# Altium schematic sheet fx3_a.SchDoc: CYUSB3014 - A
size OrCAD B; CheckedBy: liuchao; DrawnBy: liuchao; DocumentNumber: APEX-USB4; Revision: 3.0.0; SheetNumber: 4; SheetTotal: 9
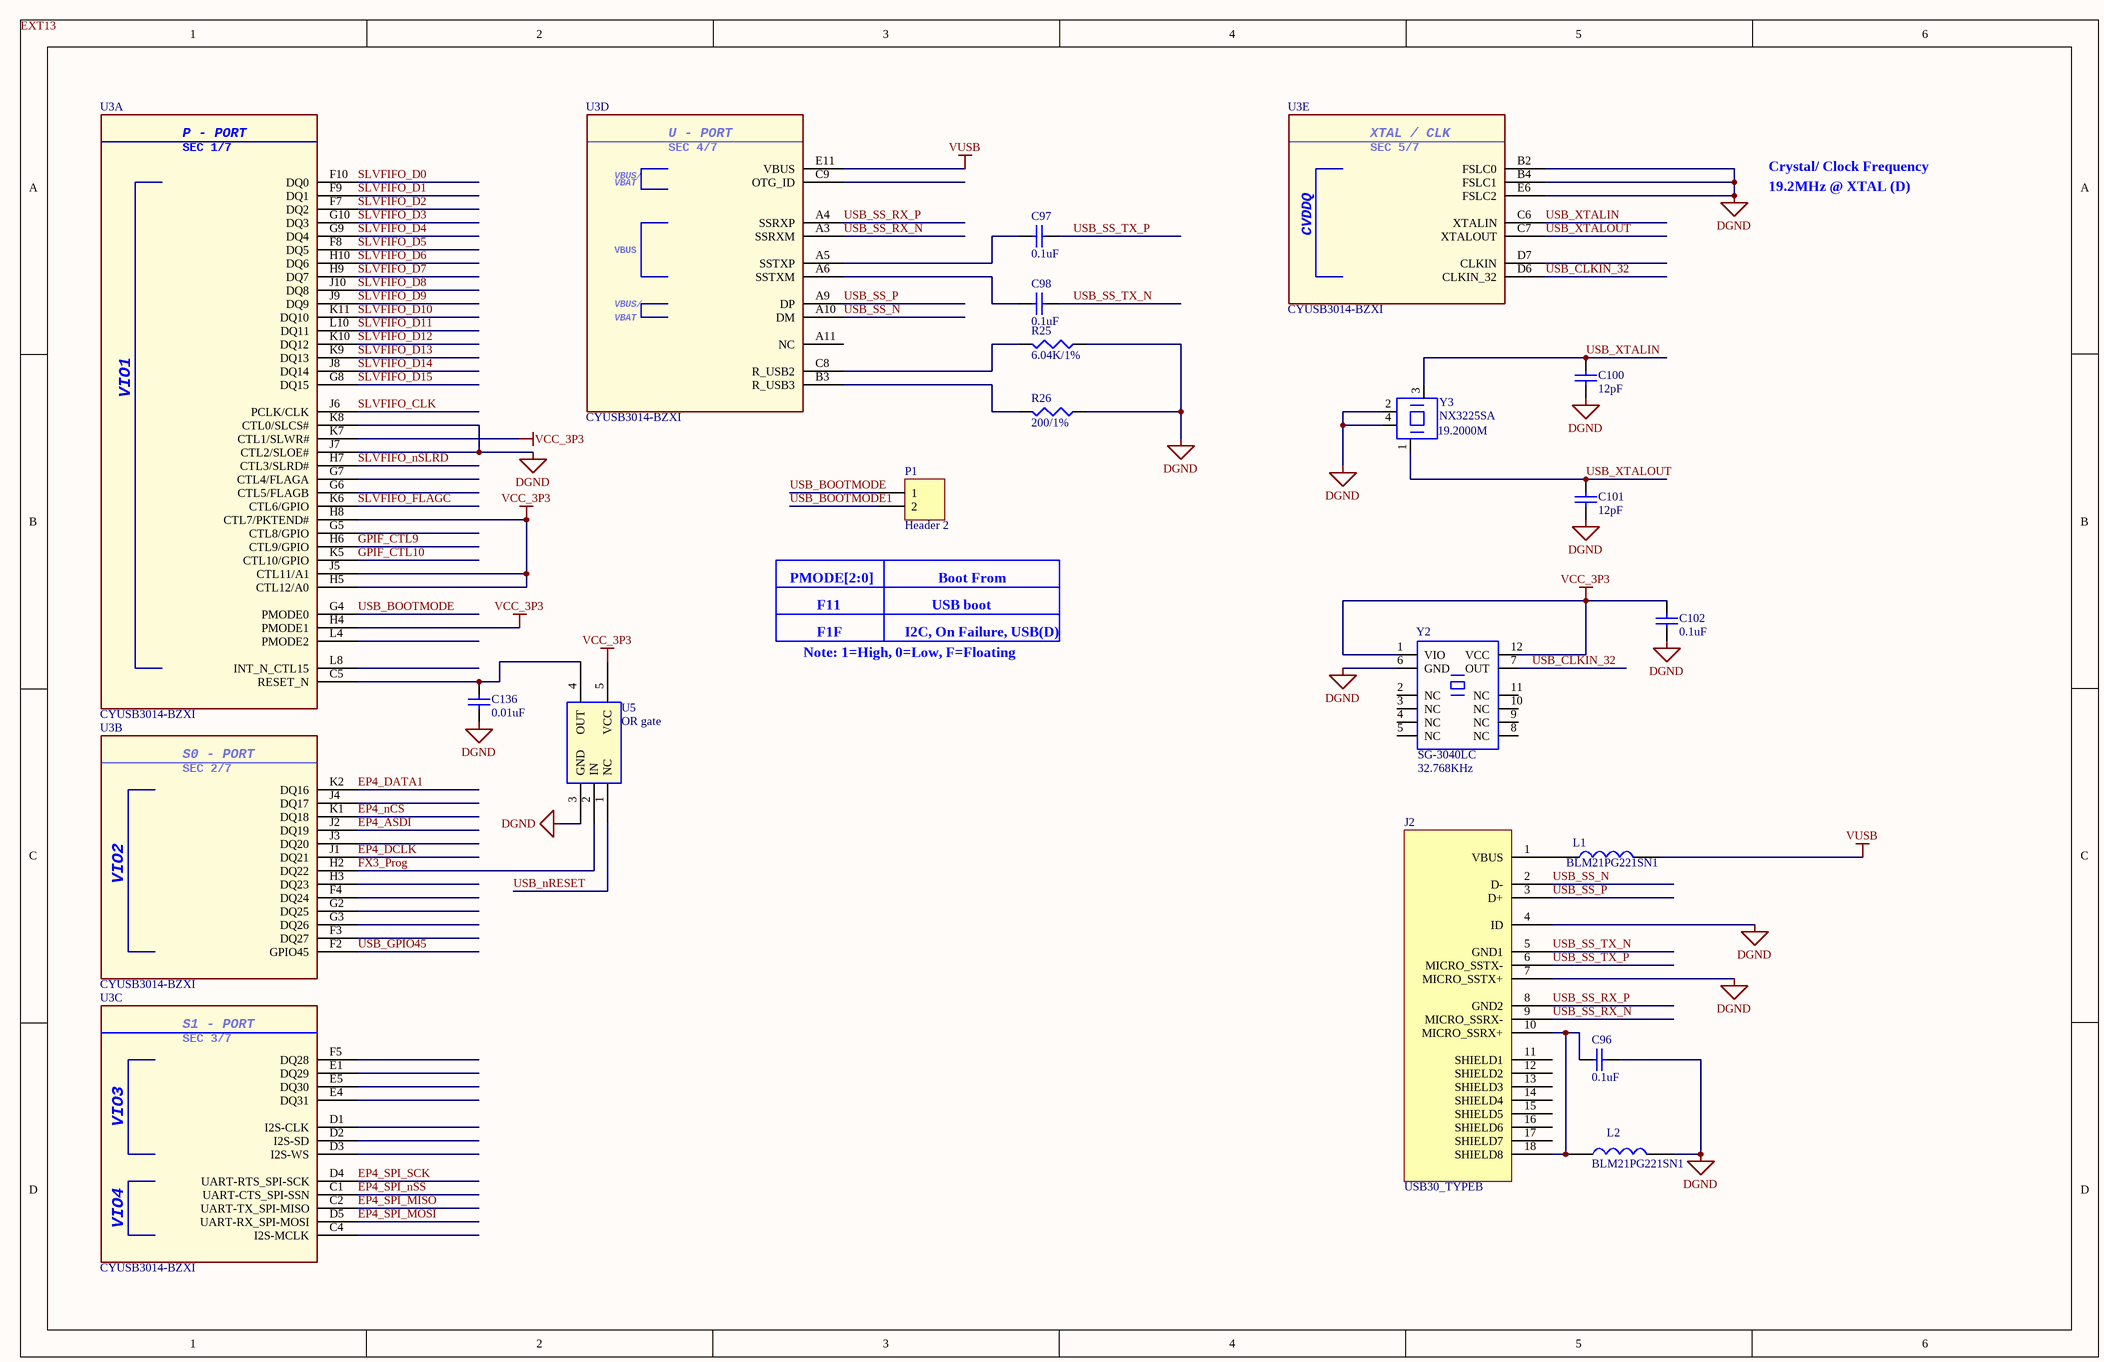
[diagram p0: fx3_a.SchDoc]

## Parts
C96  value 0.1uF  [C_0402]  (hidden comment: Capacitor)
C97  value 0.1uF  [C_0402]  (hidden comment: Capacitor)
C98  value 0.1uF  [C_0402]  (hidden comment: Capacitor)
C100  value 12pF  [C_0402]  (hidden comment: Capacitor)
C101  value 12pF  [C_0402]  (hidden comment: Capacitor)
C102  value 0.1uF  [C_0402]  (hidden comment: Capacitor)
C136  value 0.01uF  [C_0402]  (hidden comment: Capacitor)
J2  USB30_TYPEB  [USB3.0 typeB]
L1  BLM21PG221SN1  [SMD_0805]
L2  BLM21PG221SN1  [SMD_0805]
P1  Header 2  [HDR1X2]
R25  value 6.04K/1%  [J1-0603]  (hidden comment: Resistor)
R26  value 200/1%  [J1-0603]  (hidden comment: Resistor)
U3  CYUSB3014-BZXI  [CYP-BZX121]  (parts A,B,C,D,E of 7)
U5  OR gate  [TC7SET08FU]
Y2  SG-3040LC  value 32.768KHz  [SG-3040LC]
Y3  NX3225SA  value 19.2000M  [CRYSTAL_SMD_32X25]

## Nets
DGND: C96.2 C100.1 C101.1 C102.1 C136.2 J2.4(ID) J2.7(MICRO_SSTX+) L2.2 R25.1 R26.1 U3.B2(FSLC0) U3.B4(FSLC1) U3.E6(FSLC2) U3.J7(CTL2/SLOE#) U3.K8(CTL0/SLCS#) U5.3(GND) Y2.6(GND) Y3.2 Y3.4
VCC_3P3: C102.2 U3.H4(PMODE1) U3.H5(CTL12/A0) U3.H8(CTL7/PKTEND#) U3.J5(CTL11/A1) U3.K7(CTL1/SLWR#) U5.5(VCC) Y2.1(VIO) Y2.12(VCC)
VUSB: L1.2 U3.E11(VBUS)
EP4_ASDI: U3.J2(DQ19)
EP4_DATA1: U3.K2(DQ16)
EP4_DCLK: U3.J1(DQ21)
EP4_nCS: U3.K1(DQ18)
EP4_SPI_MISO: U3.C2(UART-TX_SPI-MISO)
EP4_SPI_MOSI: U3.D5(UART-RX_SPI-MOSI)
EP4_SPI_nSS: U3.C1(UART-CTS_SPI-SSN)
EP4_SPI_SCK: U3.D4(UART-RTS_SPI-SCK)
FX3_Prog: U3.H2(DQ22) U5.2(IN)
GPIF_CTL9: U3.H6(CTL9/GPIO)
GPIF_CTL10: U3.K5(CTL10/GPIO)
SLVFIFO_CLK: U3.J6(PCLK/CLK)
SLVFIFO_D0: U3.F10(DQ0)
SLVFIFO_D1: U3.F9(DQ1)
SLVFIFO_D2: U3.F7(DQ2)
SLVFIFO_D3: U3.G10(DQ3)
SLVFIFO_D4: U3.G9(DQ4)
SLVFIFO_D5: U3.F8(DQ5)
SLVFIFO_D6: U3.H10(DQ6)
SLVFIFO_D7: U3.H9(DQ7)
SLVFIFO_D8: U3.J10(DQ8)
SLVFIFO_D9: U3.J9(DQ9)
SLVFIFO_D10: U3.K11(DQ10)
SLVFIFO_D11: U3.L10(DQ11)
SLVFIFO_D12: U3.K10(DQ12)
SLVFIFO_D13: U3.K9(DQ13)
SLVFIFO_D14: U3.J8(DQ14)
SLVFIFO_D15: U3.G8(DQ15)
SLVFIFO_FLAGC: U3.K6(CTL6/GPIO)
SLVFIFO_nSLRD: U3.H7(CTL3/SLRD#)
USB_BOOTMODE: P1.1 U3.G4(PMODE0)
USB_BOOTMODE1: P1.2
USB_CLKIN_32: U3.D6(CLKIN_32) Y2.7(OUT)
USB_GPIO45: U3.F2(GPIO45)
USB_nRESET: U5.1(NC)
USB_SS_N: J2.2(D-) U3.A10(DM)
USB_SS_P: J2.3(D+) U3.A9(DP)
USB_SS_RX_N: J2.9(MICRO_SSRX-) U3.A3(SSRXM)
USB_SS_RX_P: J2.8(GND2) U3.A4(SSRXP)
USB_SS_TX_N: C98.2 J2.5(GND1)
USB_SS_TX_P: C97.2 J2.6(MICRO_SSTX-)
USB_XTALIN: C100.2 U3.C6(XTALIN) Y3.3
USB_XTALOUT: C101.2 U3.C7(XTALOUT) Y3.1
NetC96_1: C96.1 J2.10(MICRO_SSRX+) J2.18(SHIELD8) L2.1
NetC97_1: C97.1 U3.A5(SSTXP)
NetC98_1: C98.1 U3.A6(SSTXM)
NetC136_1: C136.1 U3.C5(RESET_N) U5.4(OUT)
NetJ2_1: J2.1(VBUS) L1.1
NetR25_2: R25.2 U3.C8(R_USB2)
NetR26_2: R26.2 U3.B3(R_USB3)

Not connected (* = marked no-connect by the designer): J2 11(SHIELD1) 12(SHIELD2) 13(SHIELD3) 14(SHIELD4) 15(SHIELD5) 16(SHIELD6) 17(SHIELD7); U3 A11(NC) C4(I2S-MCLK) C9(OTG_ID) D1(I2S-CLK) D2(I2S-SD) D3(I2S-WS) D7(CLKIN) E1(DQ29) E4(DQ31) E5(DQ30) F3(DQ27) F4(DQ24) F5(DQ28) G2(DQ25) G3(DQ26) G5(CTL8/GPIO) G6(CTL5/FLAGB) G7(CTL4/FLAGA) H3(DQ23) J3(DQ20) J4(DQ17) L4(PMODE2) L8(INT_N_CTL15); Y2 2(NC) 3(NC) 4(NC) 5(NC) 8(NC) 9(NC) 10(NC) 11(NC)

## Notes on the sheet
- Crystal/ Clock Frequency
- 19.2MHz @ XTAL (D)
- PMODE[2:0]
- F11
- F1F
- I2C, On Failure, USB(D)
- USB boot
- Boot From
- Note: 1=High, 0=Low, F=Floating
- Labels drawn without touching a wire or pin: EXT13
- (in symbol CYUSB30XX, part A) P - PORT; SEC 1/7; VIO1
- (in symbol CYUSB30XX, part B) S0 - PORT; SEC 2/7
- (in symbol CYUSB30XX, part C) S1 - PORT; SEC 3/7
- (in symbol CYUSB30XX, part D) U - PORT; SEC 4/7; VBUS/
- (in symbol CYUSB30XX, part E) XTAL / CLK; SEC 5/7

## Library data of the parts
C96-C98 C100-C102 C136 = Cap Semi: Capacitor (Semiconductor SIM Model); Published: 8-Jun-2000; LatestRevisionDate: 29-May-2009; LatestRevisionNote: IPC-7351 Footprint Added.; PackageReference: C1206; Publisher: Altium Limited; PackageDescription: Chip Capacitor
J2 = USB30_TYPEB: USB30_MICRO_TYPEB; pin to pad: 10>A 11>none 12>none 13>none 14>none 15>none 16>none 17>none 18>B
L1 L2 = BLM21PXXX: Chip Ferrite Bead
P1 = Header 2: Header, 2-Pin; LatestRevisionDate: 17-Jul-2002; LatestRevisionNote: Re-released for DXP Platform.; Publisher: Altium Limited
R25 R26 = Res3: Published: 8-Jun-2000; LatestRevisionDate: 29-May-2009; LatestRevisionNote: IPC-7351 Footprint Added.; PackageReference: J1-0603; Publisher: Altium Limited; PackageDescription: Chip Resistor
U3 = CYUSB30XX: FX3 CYUSB3014
U5 = INVERTER
Y2 = SG3040: CRYSTAL
Y3 = NX3225SA: CRYSTAL